# EAGLE design chall (EAGLE 9.6.2)
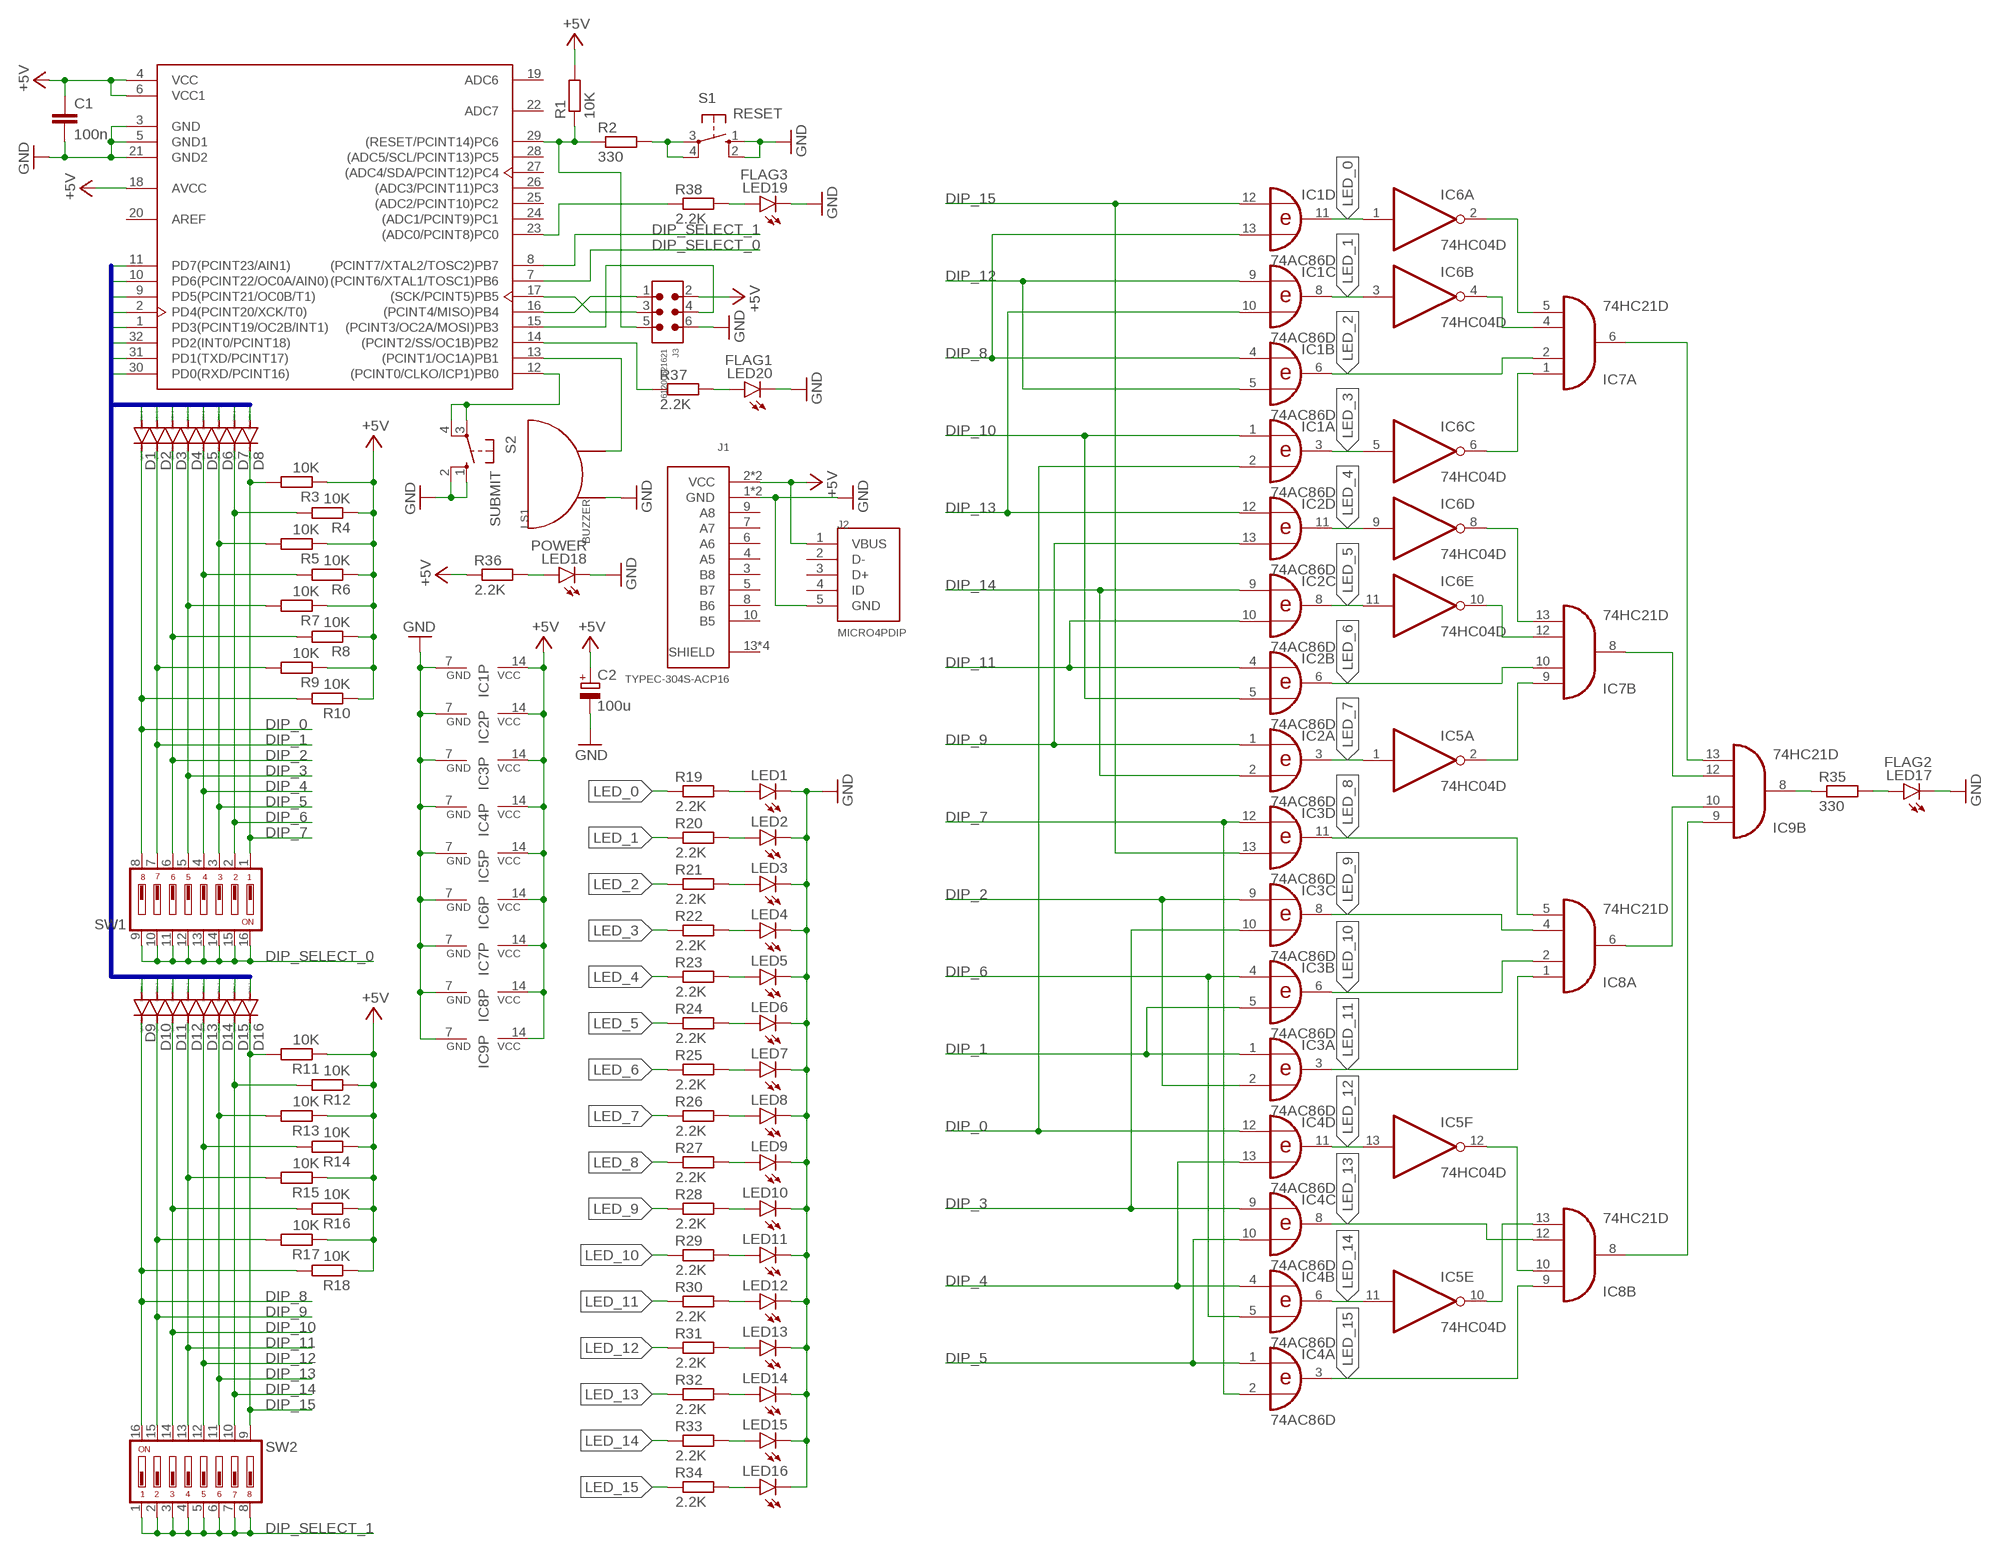
[diagram p0: schematic, sheet 1]

## Parts
C1  100n  C-EUC0805  [C0805]
C2  100u  CPOL-EUE2-5  [E2-5]
D1  DIODE-DO-214AC  [DO-214AC]
D2  DIODE-DO-214AC  [DO-214AC]
D3  DIODE-DO-214AC  [DO-214AC]
D4  DIODE-DO-214AC  [DO-214AC]
D5  DIODE-DO-214AC  [DO-214AC]
D6  DIODE-DO-214AC  [DO-214AC]
D7  DIODE-DO-214AC  [DO-214AC]
D8  DIODE-DO-214AC  [DO-214AC]
D9  DIODE-DO-214AC  [DO-214AC]
D10  DIODE-DO-214AC  [DO-214AC]
D11  DIODE-DO-214AC  [DO-214AC]
D12  DIODE-DO-214AC  [DO-214AC]
D13  DIODE-DO-214AC  [DO-214AC]
D14  DIODE-DO-214AC  [DO-214AC]
D15  DIODE-DO-214AC  [DO-214AC]
D16  DIODE-DO-214AC  [DO-214AC]
IC1  74AC86D  [SO14]
IC2  74AC86D  [SO14]
IC3  74AC86D  [SO14]
IC4  74AC86D  [SO14]
IC5  74HC04D  [SO14]
IC6  74HC04D  [SO14]
IC7  74HC21D  [SO14]
IC8  74HC21D  [SO14]
IC9  74HC21D  [SO14]
J1  TYPEC-304S-ACP16  [TYPEC-304S-ACP16]
J2  MICRO4PDIP  [MICRO4PDIP]
J3  61200621621  6120XX21621_61200621621  [61200621621]
LED1  LEDCHIPLED_0603  [CHIPLED_0603]
LED2  LEDCHIPLED_0603  [CHIPLED_0603]
LED3  LEDCHIPLED_0603  [CHIPLED_0603]
LED4  LEDCHIPLED_0603  [CHIPLED_0603]
LED5  LEDCHIPLED_0603  [CHIPLED_0603]
LED6  LEDCHIPLED_0603  [CHIPLED_0603]
LED7  LEDCHIPLED_0603  [CHIPLED_0603]
LED8  LEDCHIPLED_0603  [CHIPLED_0603]
LED9  LEDCHIPLED_0603  [CHIPLED_0603]
LED10  LEDCHIPLED_0603  [CHIPLED_0603]
LED11  LEDCHIPLED_0603  [CHIPLED_0603]
LED12  LEDCHIPLED_0603  [CHIPLED_0603]
LED13  LEDCHIPLED_0603  [CHIPLED_0603]
LED14  LEDCHIPLED_0603  [CHIPLED_0603]
LED15  LEDCHIPLED_0603  [CHIPLED_0603]
LED16  LEDCHIPLED_0603  [CHIPLED_0603]
LED17  FLAG2  LEDCHIPLED_0603  [CHIPLED_0603]
LED18  POWER  LEDCHIPLED_0603  [CHIPLED_0603]
LED19  FLAG3  LEDCHIPLED_0603  [CHIPLED_0603]
LED20  FLAG1  LEDCHIPLED_0603  [CHIPLED_0603]
LS1  BUZZER  [BUZZER]
R1  10K  R-EU_R0805  [R0805]
R2  330  R-EU_R0805  [R0805]
R3  10K  R-EU_R0805  [R0805]
R4  10K  R-EU_R0805  [R0805]
R5  10K  R-EU_R0805  [R0805]
R6  10K  R-EU_R0805  [R0805]
R7  10K  R-EU_R0805  [R0805]
R8  10K  R-EU_R0805  [R0805]
R9  10K  R-EU_R0805  [R0805]
R10  10K  R-EU_R0805  [R0805]
R11  10K  R-EU_R0805  [R0805]
R12  10K  R-EU_R0805  [R0805]
R13  10K  R-EU_R0805  [R0805]
R14  10K  R-EU_R0805  [R0805]
R15  10K  R-EU_R0805  [R0805]
R16  10K  R-EU_R0805  [R0805]
R17  10K  R-EU_R0805  [R0805]
R18  10K  R-EU_R0805  [R0805]
R19  2.2K  R-EU_R0805  [R0805]
R20  2.2K  R-EU_R0805  [R0805]
R21  2.2K  R-EU_R0805  [R0805]
R22  2.2K  R-EU_R0805  [R0805]
R23  2.2K  R-EU_R0805  [R0805]
R24  2.2K  R-EU_R0805  [R0805]
R25  2.2K  R-EU_R0805  [R0805]
R26  2.2K  R-EU_R0805  [R0805]
R27  2.2K  R-EU_R0805  [R0805]
R28  2.2K  R-EU_R0805  [R0805]
R29  2.2K  R-EU_R0805  [R0805]
R30  2.2K  R-EU_R0805  [R0805]
R31  2.2K  R-EU_R0805  [R0805]
R32  2.2K  R-EU_R0805  [R0805]
R33  2.2K  R-EU_R0805  [R0805]
R34  2.2K  R-EU_R0805  [R0805]
R35  330  R-EU_R0805  [R0805]
R36  2.2K  R-EU_R0805  [R0805]
R37  2.2K  R-EU_R0805  [R0805]
R38  2.2K  R-EU_R0805  [R0805]
S1  RESET  10-XX  [B3F-10XX]
S2  SUBMIT  10-XX  [B3F-10XX]
SW1  DS08  [DS-08]
SW2  DS08  [DS-08]
U1  ATMEGA328P-AU  [TQFP-32]

## Nets
0: D1.A D16.A U1.30(PD0(RXD/PCINT16))
1: D2.A D15.A U1.31(PD1(TXD/PCINT17))
2: D3.A D14.A U1.32(PD2(INT0/PCINT18))
3: D4.A D13.A U1.1(PD3(PCINT19/OC2B/INT1))
4: D5.A D12.A U1.2(PD4(PCINT20/XCK/T0))
5: D6.A D11.A U1.9(PD5(PCINT21/OC0B/T1))
6: D7.A D10.A U1.10(PD6(PCINT22/OC0A/AIN0))
7: D8.A D9.A U1.11(PD7(PCINT23/AIN1))
+5V: C1.1 C2.+ IC1.14(P:VCC) IC2.14(P:VCC) IC3.14(P:VCC) IC4.14(P:VCC) IC5.14(P:VCC) IC6.14(P:VCC) IC7.14(P:VCC) IC8.14(P:VCC) IC9.14(P:VCC) J1.2(VCC) J1.11(VCC) J2.1(VBUS) J3.2 R1.2 R3.1 R4.1 R5.1 R6.1 R7.1 R8.1 R9.1 R10.1 R11.1 R12.1 R13.1 R14.1 R15.1 R16.1 R17.1 R18.1 R36.1 U1.4(VCC) U1.6(VCC1) U1.18(AVCC)
DIP_0: D1.C IC1.2(A:I1) IC4.12(D:I0) R10.2 SW1.8
DIP_1: D2.C IC3.1(A:I0) IC3.5(B:I1) R9.2 SW1.7
DIP_2: D3.C IC3.2(A:I1) IC3.9(C:I0) R8.2 SW1.6
DIP_3: D4.C IC3.10(C:I1) IC4.9(C:I0) R7.2 SW1.5
DIP_4: D5.C IC4.4(B:I0) IC4.13(D:I1) R6.2 SW1.4
DIP_5: D6.C IC4.1(A:I0) IC4.10(C:I1) R5.2 SW1.3
DIP_6: D7.C IC3.4(B:I0) IC4.5(B:I1) R4.2 SW1.2
DIP_7: D8.C IC3.12(D:I0) IC4.2(A:I1) R3.2 SW1.1
DIP_8: D9.C IC1.4(B:I0) IC1.13(D:I1) R18.2 SW2.16
DIP_9: D10.C IC2.1(A:I0) IC2.13(D:I1) R17.2 SW2.15
DIP_10: D11.C IC1.1(A:I0) IC2.5(B:I1) R16.2 SW2.14
DIP_11: D12.C IC2.4(B:I0) IC2.10(C:I1) R15.2 SW2.13
DIP_12: D13.C IC1.5(B:I1) IC1.9(C:I0) R14.2 SW2.12
DIP_13: D14.C IC1.10(C:I1) IC2.12(D:I0) R13.2 SW2.11
DIP_14: D15.C IC2.2(A:I1) IC2.9(C:I0) R12.2 SW2.10
DIP_15: D16.C IC1.12(D:I0) IC3.13(D:I1) R11.2 SW2.9
DIP_SELECT_0: SW1.9 SW1.10 SW1.11 SW1.12 SW1.13 SW1.14 SW1.15 SW1.16 U1.7((PCINT6/XTAL1/TOSC1)PB6)
DIP_SELECT_1: SW2.1 SW2.2 SW2.3 SW2.4 SW2.5 SW2.6 SW2.7 SW2.8 U1.8((PCINT7/XTAL2/TOSC2)PB7)
GND: C1.2 C2.- IC1.7(P:GND) IC2.7(P:GND) IC3.7(P:GND) IC4.7(P:GND) IC5.7(P:GND) IC6.7(P:GND) IC7.7(P:GND) IC8.7(P:GND) IC9.7(P:GND) J1.1(GND) J1.12(GND) J2.5(GND) J3.6 LED1.C LED2.C LED3.C LED4.C LED5.C LED6.C LED7.C LED8.C LED9.C LED10.C LED11.C LED12.C LED13.C LED14.C LED15.C LED16.C LED17.C LED18.C LED19.C LED20.C LS1.1 S1.1(S) S1.2(S1) S2.1(S) S2.2(S1) U1.3(GND) U1.5(GND1) U1.21(GND2)
LED_0: IC1.11(D:O) IC6.1(A:I) R19.1
LED_1: IC1.8(C:O) IC6.3(B:I) R20.1
LED_2: IC1.6(B:O) IC7.2(A:I1) R21.1
LED_3: IC1.3(A:O) IC6.5(C:I) R22.1
LED_4: IC2.11(D:O) IC6.9(D:I) R23.1
LED_5: IC2.8(C:O) IC6.11(E:I) R24.1
LED_6: IC2.6(B:O) IC7.10(B:I1) R25.1
LED_7: IC2.3(A:O) IC5.1(A:I) R26.1
LED_8: IC3.11(D:O) IC8.5(A:I3) R27.1
LED_9: IC3.8(C:O) IC8.4(A:I2) R28.1
LED_10: IC3.6(B:O) IC8.2(A:I1) R29.1
LED_11: IC3.3(A:O) IC8.1(A:I0) R30.1
LED_12: IC4.11(D:O) IC5.13(F:I) R31.1
LED_13: IC4.8(C:O) IC8.12(B:I2) R32.1
LED_14: IC4.6(B:O) IC5.11(E:I) R33.1
LED_15: IC4.3(A:O) IC8.9(B:I0) R34.1
N$1: R2.2 S1.3(P) S1.4(P1)
N$2: LED2.A R20.2
N$3: J3.5 R1.1 R2.1 U1.29((RESET/PCINT14)PC6)
N$4: J3.3 U1.17((SCK/PCINT5)PB5)
N$5: IC6.2(A:O) IC7.5(A:I3)
N$6: IC6.4(B:O) IC7.4(A:I2)
N$7: LED3.A R21.2
N$8: IC6.6(C:O) IC7.1(A:I0)
N$9: IC6.8(D:O) IC7.13(B:I3)
N$10: IC6.10(E:O) IC7.12(B:I2)
N$11: LED4.A R22.2
N$12: IC5.2(A:O) IC7.9(B:I0)
N$13: LED5.A R23.2
N$14: LED6.A R24.2
N$15: LED7.A R25.2
N$16: LED8.A R26.2
N$17: IC5.12(F:O) IC8.10(B:I1)
N$18: LED9.A R27.2
N$19: IC5.10(E:O) IC8.13(B:I3)
N$20: LED10.A R28.2
N$21: IC7.8(B:O) IC9.12(B:I2)
N$22: IC7.6(A:O) IC9.13(B:I3)
N$23: IC8.6(A:O) IC9.10(B:I1)
N$24: IC8.8(B:O) IC9.9(B:I0)
N$25: LED11.A R29.2
N$26: LED12.A R30.2
N$27: LED13.A R31.2
N$28: LED14.A R32.2
N$29: LED15.A R33.2
N$30: LED16.A R34.2
N$31: S2.3(P) S2.4(P1) U1.12((PCINT0/CLKO/ICP1)PB0)
N$32: LED19.A R38.2
N$33: LED1.A R19.2
N$34: R38.1 U1.23((ADC0/PCINT8)PC0)
N$35: LED20.A R37.2
N$37: LED17.A R35.2
N$50: IC9.8(B:O) R35.1
N$51: LS1.2 U1.13((PCINT1/OC1A)PB1)
N$52: LED18.A R36.2
N$53: J3.1 U1.16((PCINT4/MISO)PB4)
N$54: J3.4 U1.15((PCINT3/OC2A/MOSI)PB3)
N$55: R37.1 U1.14((PCINT2/SS/OC1B)PB2)
Unconnected: IC5.3(B:I) IC5.4(B:O) IC5.5(C:I) IC5.6(C:O) IC5.8(D:O) IC5.9(D:I) IC6.12(F:O) IC6.13(F:I) IC9.1(A:I0) IC9.2(A:I1) IC9.4(A:I2) IC9.5(A:I3) IC9.6(A:O) J1.3(B8) J1.4(A5) J1.5(B7) J1.6(A6) J1.7(A7) J1.8(B6) J1.9(A8) J1.10(B5) J1.13(SHIELD) J1.14(SHIELD) J1.15(SHIELD) J1.16(SHIELD) J2.2(D-) J2.3(D+) J2.4(ID) U1.19(ADC6) U1.22(ADC7) U1.24((ADC1/PCINT9)PC1) U1.25((ADC2/PCINT10)PC2) U1.26((ADC3/PCINT11)PC3) U1.27((ADC4/SDA/PCINT12)PC4) U1.28((ADC5/SCL/PCINT13)PC5)

## Buses
DIPSWITCH:0,1,2,3,4,5,6,7

## Power pins joined to a net without a drawn wire
AREF: U1.20(AREF)

## Library data of the parts
C1 = rcl:C-EU: CAPACITOR, European symbol; SPICEPREFIX: C
C2 = rcl:CPOL-EU: POLARIZED CAPACITOR, European symbol; SPICEPREFIX: C
D1-D16 = diode:DIODE-: DIODE
IC1-IC4 = 74xx-eu:74*86: Quad 2-input EXCLUSIVE-OR (XOR) gate
IC5 IC6 = 74xx-eu:74*04: Hex INVERTER
IC7-IC9 = 74xx-eu:74*21: Dual 4-input AND gate
J1 = hardwarechall:TYPEC-304S-ACP16
J2 = hardwarechall:MICRO4PDIP
J3 = Wurth_Connectors_WR-BHD:6120XX21621_61200621621: WR-BHD 2.54 mm Male Box Header KIND PROPERTIES: Pitch 2.54 mm Gender:Male MATERIAL PROPERTIES: Insulator Material:PBT Insulator Flammability Rating UL94 V-0 Insulator Color:Black Contact Material :Copper Alloy Contact Plating :Gold Contact Type: Stamped GENERAL INFORMATION: Operating Temperature:-40 °C up to +125 °C Compliance:RoHS Working Voltage: 250 V (AC) Withstanding Voltage:500 V (AC) Contact Resistance: 20 mΩ Insulation Resistance:1000 MΩ CERTIFICATION: UL Approval:E323964 PACKAGING PROPERTIES Packaging :Tray <https://www.we-online.com/catalog/media/o32884v209%20Family_WR-BHD_6120xx21621.jpg> Details see: https://www.we-online.com/catalog/en/BHD_2_54_MALE_BOX_HEADER_6120XX21621 Updated by Ella Wu 2021-3-12 2021 (C) Würth Elektronik; CONTACT-RESISTANCE: 20mOhm; DATASHEET-URL: https://www.we-online.com/catalog/datasheet/61200621621.pdf; GENDER: Male; IR: 3A; L: 15.28mm; MOUNT: THT; PACKAGING: Tray; PART-NUMBER: 61200621621; PINS: 6; PITCH: 2.54mm; TYPE: Straight; WORKING-VOLTAGE: 250V(AC)
LED1-LED20 = led:LED: LED OSRAM: - CHIPLED LG R971, LG N971, LY N971, LG Q971, LY Q971, LO R971, LY R971 LH N974, LH R974 LS Q976, LO Q976, LY Q976 LO Q996 - Hyper CHIPLED LW Q18S LB Q993, LB Q99A, LB R99A - SideLED LS A670, LO A670, LY A670, LG A670, LP A670 LB A673, LV A673, LT A673, LW A673 LH A674 LY A675 LS A676, LA A676, LO A676, LY A676, LW A676 LS A679, LY A679, LG A679 - Hyper Micro SIDELED® LS Y876, LA Y876, LO Y876, LY Y876 LT Y87S - SmartLED LW L88C, LW L88S LB L89C, LB L89S, LG L890 LS L89K, LO L89K, LY L89K LS L896, LA L896, LO L896, LY L896 - TOPLED LS T670, LO T670, LY T670, LG T670, LP T670 LSG T670, LSP T670, LSY T670, LOP T670, LYG T670 LG T671, LOG T671, LSG T671 LB T673, LV T673, LT T673, LW T673 LH T674 LS T676, LA T676, LO T676, LY T676, LB T676, LH T676, LSB T676, LW T676 LB T67C, LV T67C, LT T67C, LS T67K, LO T67K, LY T67K, LW E67C LS E67B, LA E67B, LO E67B, LY E67B, LB E67C, LV E67C, LT E67C LW T67C LS T679, LY T679, LG T679 LS T770, LO T770, LY T770, LG T770, LP T770 LB T773, LV T773, LT T773, LW T773 LH T774 LS E675, LA E675, LY E675, LS T675 LS T776, LA T776, LO T776, LY T776, LB T776 LHGB T686 LT T68C, LB T68C - Hyper Mini TOPLED® LB M676 - Mini TOPLED Santana® LG M470 LS M47K, LO M47K, LY M47K Source: http://www.osram.convergy.de LUXEON: - LUMILED® LXK2-PW12-R00, LXK2-PW12-S00, LXK2-PW14-U00, LXK2-PW14-V00 LXK2-PM12-R00, LXK2-PM12-S00, LXK2-PM14-U00 LXK2-PE12-Q00, LXK2-PE12-R00, LXK2-PE12-S00, LXK2-PE14-T00, LXK2-PE14-U00 LXK2-PB12-K00, LXK2-PB12-L00, LXK2-PB12-M00, LXK2-PB14-N00, LXK2-PB14-P00, LXK2-PB14-Q00 LXK2-PR12-L00, LXK2-PR12-M00, LXK2-PR14-Q00, LXK2-PR14-R00 LXK2-PD12-Q00, LXK2-PD12-R00, LXK2-PD12-S00 LXK2-PH12-R00, LXK2-PH12-S00 LXK2-PL12-P00, LXK2-PL12-Q00, LXK2-PL12-R00 Source: www.luxeon.com KINGBRIGHT: KA-3528ASYC Source: www.kingbright.com
LS1 = hardwarechall:BUZZER
R1-R38 = rcl:R-EU_: RESISTOR, European symbol; SPICEPREFIX: R
S1 S2 = switch-omron:10-XX: OMRON SWITCH; MPN: B3F-1000; OC_FARNELL: 176432; OC_NEWARK: 36M3542
SW1 SW2 = switch-dil:DS08: DIL/CODE SWITCH; MPN: DS08; OC_FARNELL: unknown; OC_NEWARK: 73J0071
U1 = Microcontroller:ATMEGA328P-AU: IC MCU 8BIT 32KB FLASH 32TQFP Manufacturer's datasheet <http://ww1.microchip.com/downloads/en/DeviceDoc/ATmega48A-PA-88A-PA-168A-PA-328-P-DS-DS40002061A.pdf>; CREATED_BY: PCBLayout.com; DIGIKEY_PART_NUMBER: ATMEGA328P-AU-ND; MANUFACTURER: Microchip Technology; MPN: ATMEGA328P-AU; PACKAGE: TQFP-32

## Board
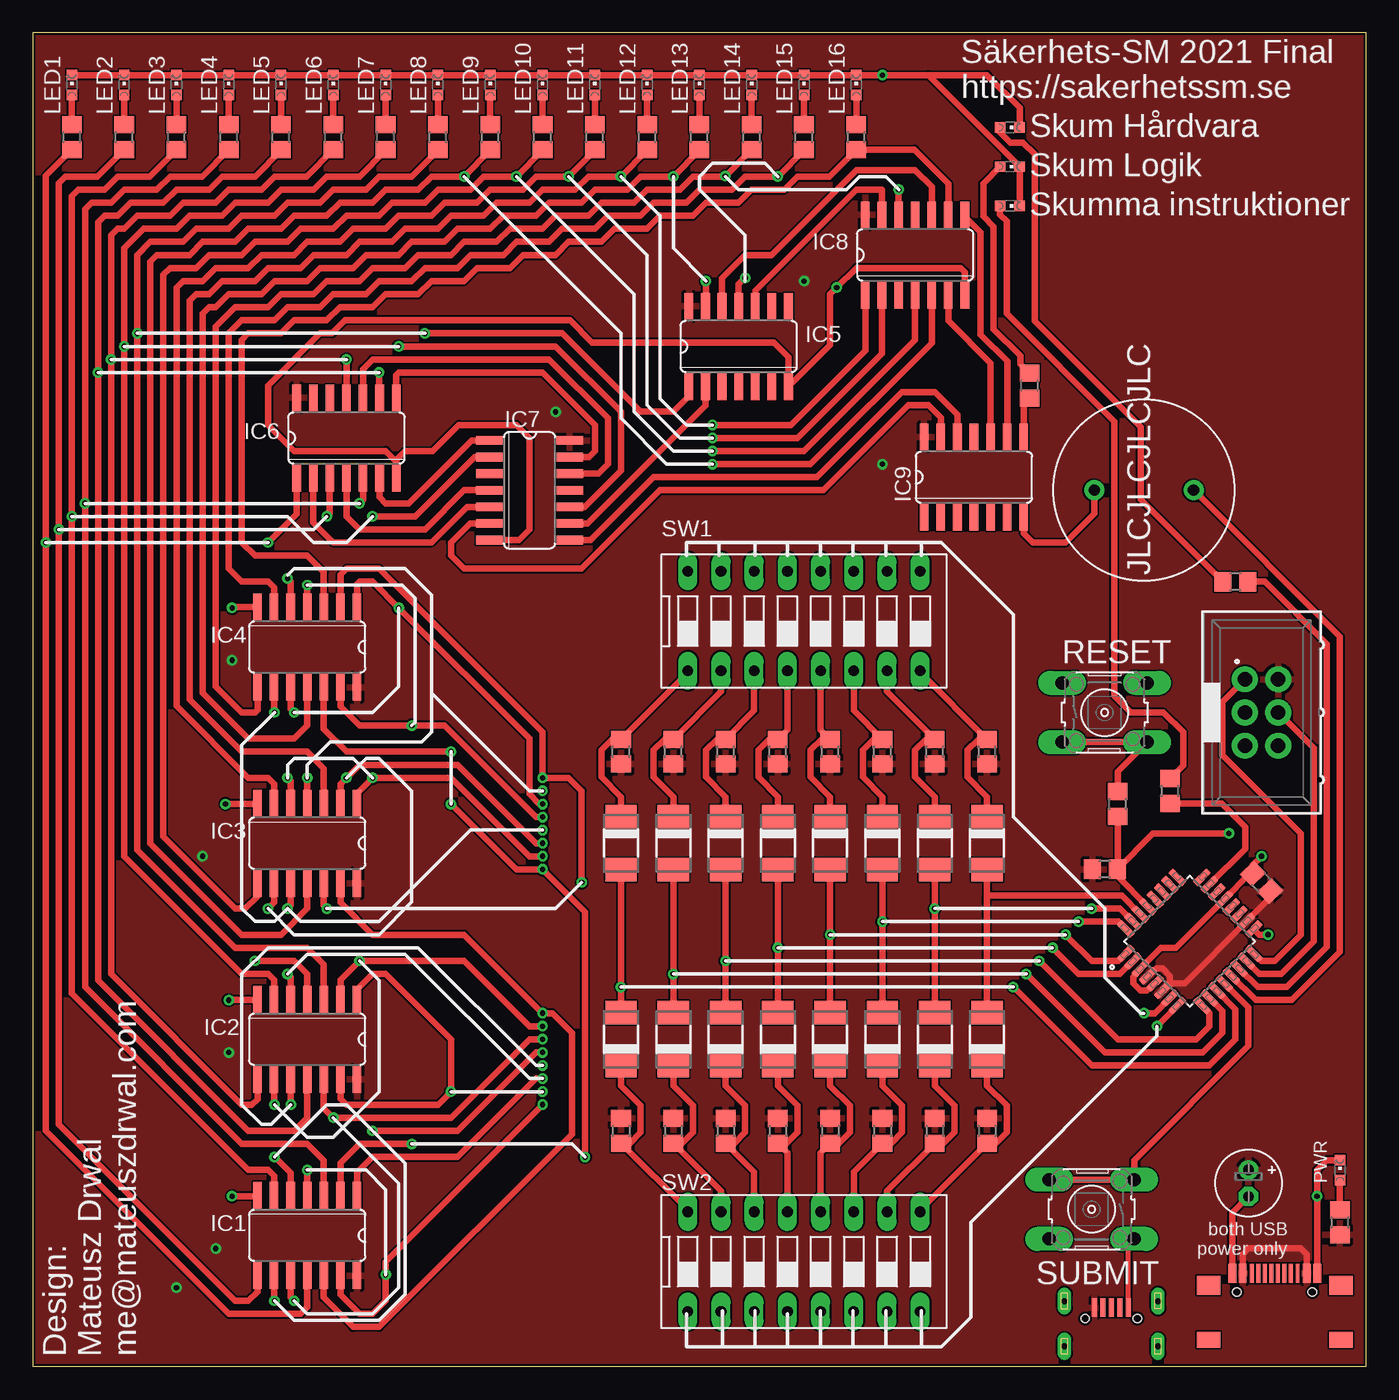
[diagram p1: board, top side]
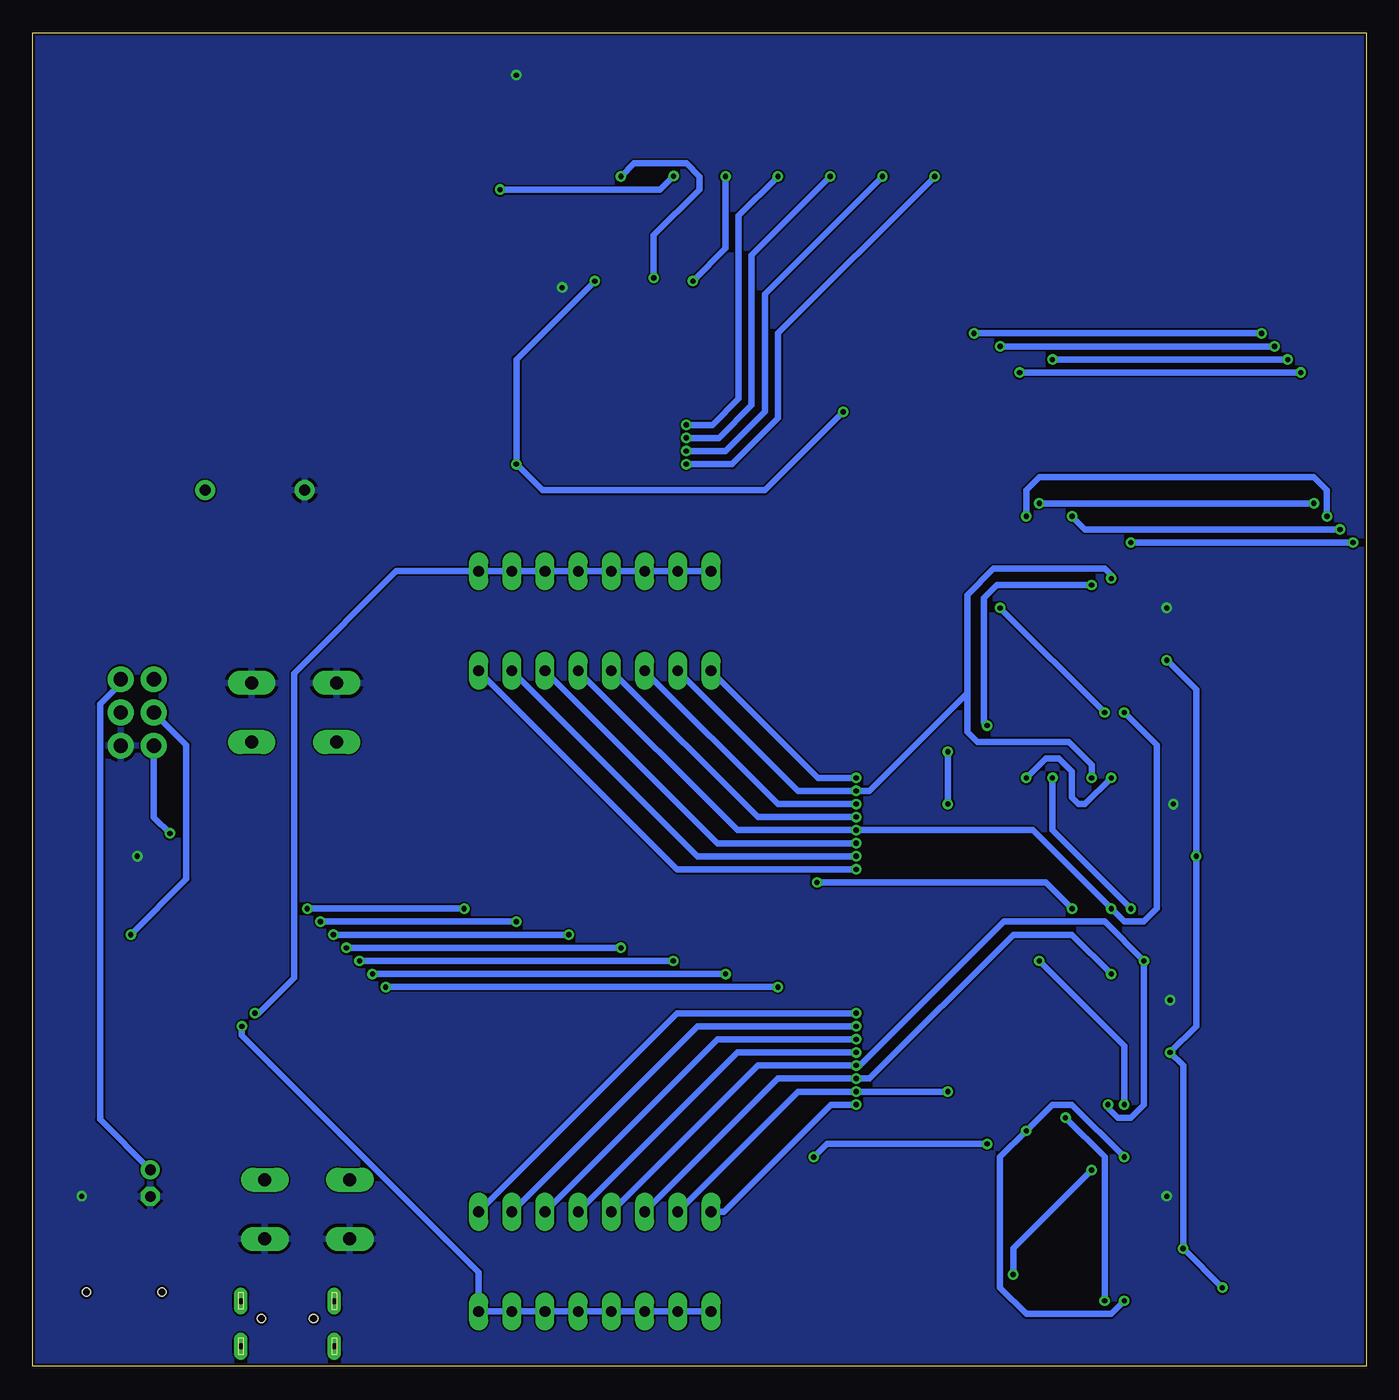
[diagram p2: board, bottom side, seen from below]

Size 102 x 102 mm. Coordinates in mm from the lower left corner, seen from the top.
Outline: 0,0 102,0 102,102 0,102 0,0
Copper layers (1*16): Top 0.035mm / dielectric 1.6mm / Bottom 0.035mm
Design rules "jlcpcb": minimum track width 5mil, minimum drill 0.3mm, track to track 5mil, track to pad 5mil, pad to pad 5mil, via to via 5mil, smd to smd 5mil, copper to edge 0.2mm, drill to drill 6mil, minimum pad ring 10mil, minimum via ring 3mil, stop-mask expansion 4mil, vias tented up to drill 0mil, thermal gap 10mil

### Footprints (pad centres in the part's own frame; a part is rotated, then mirrored left to right if it is on the bottom)
C0805 = smd 1.3 x 1.5: 1 -0.95,0; 2 0.95,0
E2-5 = drill 0.813 pad 1.27: + -1.016,0 | drill 0.813 pad 1.27 octagon: - 1.016,0
DO-214AC = smd 1.8 x 2.4: A 2.025,0; C -2.025,0
SO14 = smd 0.66 x 2.032: 1 -3.81,-3.073; 2 -2.54,-3.073; 3 -1.27,-3.073; 4 0,-3.073; 5 1.27,-3.073; 6 2.54,-3.073; 7 3.81,-3.073; 8 3.81,3.073; 9 2.54,3.073; 10 1.27,3.073; 11 0,3.073; 12 -1.27,3.073; 13 -2.54,3.073; 14 -3.81,3.073
TYPEC-304S-ACP16 = smd 0.6 x 1.45: 1 -3.25,2.615; 2 -2.45,2.615; 11 2.45,2.615; 12 3.25,2.615 | smd 0.3 x 1.45: 3 -1.75,2.615; 4 -1.25,2.615; 5 -0.75,2.615; 6 -0.25,2.615; 7 0.25,2.615; 8 0.75,2.615; 9 1.25,2.615; 10 1.75,2.615 | smd 1.8 x 1.45: 13 -5.07,1.7; 14 5.07,1.7 | smd 1.8 x 1.2: 15 -5.07,-2.48; 16 5.07,-2.48 | hole 0.65: -2.89,1.17; 2.89,1.17
MICRO4PDIP = smd 0.4 x 1.4: 1 -1.3,1.225; 2 -0.65,1.225; 3 0,1.225; 4 0.65,1.225; 5 1.3,1.225 | drill 0.45 pad 1.05 long: P$1 -3.575,1.725; P$2 3.575,1.725; P$3 3.575,-1.725; P$4 -3.575,-1.725 | hole 0.65: -2,0.4; 2,0.4
61200621621 = drill 1.1: 1 -2.54,-1.27; 2 -2.54,1.27; 3 0,-1.27; 4 0,1.27; 5 2.54,-1.27; 6 2.54,1.27
CHIPLED_0603 = smd 0.8 x 0.8: A 0,-0.75; C 0,0.75
BUZZER = drill 0.85: 1 -3.8,0; 2 3.8,0
R0805 = smd 1.3 x 1.5: 1 -0.95,0; 2 0.95,0
B3F-10XX = drill 1.016 long: 1 -3.251,2.261; 2 3.251,2.261; 3 -3.251,-2.261; 4 3.251,-2.261
DS-08 = drill 0.813 long: 1 -8.89,-3.81; 2 -6.35,-3.81; 3 -3.81,-3.81; 4 -1.27,-3.81; 5 1.27,-3.81; 6 3.81,-3.81; 7 6.35,-3.81; 8 8.89,-3.81; 9 8.89,3.81; 10 6.35,3.81; 11 3.81,3.81; 12 1.27,3.81; 13 -1.27,3.81; 14 -3.81,3.81; 15 -6.35,3.81; 16 -8.89,3.81
TQFP-32 = smd 1.5 x 0.57: 1 -4.13,2.8; 2 -4.13,2; 3 -4.13,1.2; 4 -4.13,0.4; 5 -4.13,-0.4; 6 -4.13,-1.2; 7 -4.13,-2; 8 -4.13,-2.8; 17 4.13,-2.8; 18 4.13,-2; 19 4.13,-1.2; 20 4.13,-0.4; 21 4.13,0.4; 22 4.13,1.2; 23 4.13,2; 24 4.13,2.8 | smd 0.57 x 1.5: 9 -2.8,-4.13; 10 -2,-4.13; 11 -1.2,-4.13; 12 -0.4,-4.13; 13 0.4,-4.13; 14 1.2,-4.13; 15 2,-4.13; 16 2.8,-4.13; 25 2.8,4.13; 26 2,4.13; 27 1.2,4.13; 28 0.4,4.13; 29 -0.4,4.13; 30 -1.2,4.13; 31 -2,4.13; 32 -2.8,4.13

### Placement (x,y rotation side)
C1  94,37 135 top
C2  93,14 270 top
D1  73,40 270 top
D2  69,40 270 top
D3  65,40 270 top
D4  61,40 270 top
D5  57,40 270 top
D6  53,40 270 top
D7  49,40 270 top
D8  45,40 270 top
D9  45,25 90 top
D10  49,25 90 top
D11  53,25 90 top
D12  57,25 90 top
D13  61,25 90 top
D14  65,25 90 top
D15  69,25 90 top
D16  73,25 90 top
IC1  21,10 180 top
IC2  21,25 180 top
IC3  21,40 180 top
IC4  21,55 180 top
IC5  54,78 0 top
IC6  24,71 0 top
IC7  38,67 270 top
IC8  67.5,85 0 top
IC9  72,68 0 top
J1  95,4.5 0 top
J2  82.5,3.25 0 top
J3  94,50 270 top
LED1  3,98 0 top
LED2  7,98 0 top
LED3  11,98 0 top
LED4  15,98 0 top
LED5  19,98 0 top
LED6  23,98 0 top
LED7  27,98 0 top
LED8  31,98 0 top
LED9  35,98 0 top
LED10  39,98 0 top
LED11  43,98 0 top
LED12  47,98 0 top
LED13  51,98 0 top
LED14  55,98 0 top
LED15  59,98 0 top
LED16  63,98 0 top
LED17  74.75,91.75 270 top
LED18  100,15 0 top
LED19  74.75,88.75 270 top
LED20  74.75,94.75 270 top
LS1  85,67 0 top
R1  82,38 180 top
R2  83,43 90 top
R3  45,47 90 top
R4  49,47 90 top
R5  53,47 90 top
R6  57,47 90 top
R7  61,47 90 top
R8  65,47 90 top
R9  69,47 90 top
R10  73,47 90 top
R11  73,18 270 top
R12  69,18 270 top
R13  65,18 270 top
R14  61,18 270 top
R15  57,18 270 top
R16  53,18 270 top
R17  49,18 270 top
R18  45,18 270 top
R19  3,94 90 top
R20  7,94 90 top
R21  11,94 90 top
R22  15,94 90 top
R23  19,94 90 top
R24  23,94 90 top
R25  27,94 90 top
R26  31,94 90 top
R27  35,94 90 top
R28  39,94 90 top
R29  43,94 90 top
R30  47,94 90 top
R31  51,94 90 top
R32  55,94 90 top
R33  59,94 90 top
R34  63,94 90 top
R35  76.25,75 90 top
R36  100,11 90 top
R37  92,60 180 top
R38  87,44 90 top
S1  82,50 0 top
S2  81,12 180 top
SW1  59,57 0 top
SW2  59,8 0 top
U1  88.5,32.5 45 top

### Tracks (layer width: path | path; a pad name or v marks a point on that pad's centre or on a via)
0
  Top 0.5: D16.A 73,36 | D1.A 73,36 | U1.30 83.3,36 73,36
1  (via drill 0.4 pad 0.8)
  Top 0.5: D15.A v69,35 D2.A | v81,35 83.17,35 U1.31
  Bottom 0.5: v69,35 v81,35
2  (via drill 0.4 pad 0.8)
  Top 0.5: D14.A v65,34 D3.A | v80,34 83.04,34 U1.32
  Bottom 0.5: v65,34 v80,34
3  (via drill 0.4 pad 0.8)
  Top 0.5: D4.A v61,33 D13.A | U1.1 83.04,31 81,31 v79,33
  Bottom 0.5: v61,33 v79,33
4  (via drill 0.4 pad 0.8)
  Top 0.5: D12.A v57,32 D5.A | v78,32 80,30 83.17,30 U1.2
  Bottom 0.5: v57,32 v78,32
5  (via drill 0.4 pad 0.8)
  Top 0.5: D6.A v53,31 D11.A | U1.9 90,27.04 90,26 89,25 83,25 v77,31
  Bottom 0.5: v53,31 v77,31
6  (via drill 0.4 pad 0.8)
  Top 0.5: D10.A v49,30 D7.A | v76,30 82,24 89.5,24 91,25.5 91,27.17 U1.10
  Bottom 0.5: v49,30 v76,30
7  (via drill 0.4 pad 0.8)
  Top 0.5: D8.A v45,29 D9.A | v75,29 81,23 90,23 92,25 92,27.3 U1.11
  Bottom 0.5: v45,29 v75,29
+5V  (via drill 0.4 pad 0.8)
  Top 0.5: U1.4 85.39,29.86 85.95,30.42 86.44,30.42 86.99,29.87 86.99,29.38 86.43,28.82 | 86.43,28.82 U1.6 | 86.43,28.82 86.61,28.82 87.08,29.29 88.12,29.29 U1.18 94.67,35.84 C1.1 | J1.2 92.55,8.55 93,9 97,9 97.45,8.55 J1.11
  Bottom 0.5: v15.25,54 13,51.75 v13,39 13,26 v15,24 14,23 v14,9 v11,6 | v59,83 65,77 v65,69 63,67 46,67 v40,73 | J3.2 95.27,52.23 96.84,50.65 96.84,18.86 C2.+
  pour Top: -2,104 104,104 104,-4 -2,-4
DIP_0  (via drill 0.4 pad 0.8)
  Top 0.5: D1.C 73,43.55 71.5,45.05 71.5,47.12 72.33,47.95 R10.2 67.89,53.06 SW1.8 | IC1.2 23.54,15.54 25,17 v29,17 | v42.25,16 42.25,34.75 v39,38 37,38 v32,43 | IC4.12 22.27,48.73 24,47 v32,47
  Bottom 0.5: SW1.8 52.7,38 v39,38 | v29,17 41.25,17 v42.25,16 | v32,47 v32,43
DIP_1  (via drill 0.4 pad 0.8)
  Top 0.5: D2.C 69,43.55 67.5,45.05 67.5,47.12 68.33,47.95 R9.2 65.35,51.6 SW1.7 | IC3.1 24.81,43.81 v26,45 32,45 38,39 v39,39 | IC3.5 19.73,44.77 v19.5,45
  Bottom 0.5: SW1.7 51.16,39 v39,39 | v19.5,45 21.5,43 22,43 22.5,43.5 22.5,45.5 23.5,46.5 24.5,46.5 v26,45
DIP_2  (via drill 0.4 pad 0.8)
  Top 0.5: D3.C 65,43.55 63.5,45.05 63.5,47.12 64.33,47.95 R8.2 62.81,50.14 SW1.6 | IC3.9 18.46,35.46 v18,35 | v39,40 38.5,40 32.5,46 25,46 v24,45 23.54,44.54 IC3.2
  Bottom 0.5: SW1.6 49.62,40 v39,40 | v18,35 24,41 v24,45
DIP_3  (via drill 0.4 pad 0.8)
  Top 0.5: D4.C 61,43.55 59.5,45.05 59.5,47.12 60.33,47.95 R7.2 60.27,48.68 SW1.5 | IC4.9 18.46,50.04 v18.5,50 | IC3.10 19.73,35.23 v19.5,35
  Bottom 0.5: SW1.5 48.08,41 v39,41 25.5,41 v19.5,35 18.5,34 17,34 16,35 16,47.5 v18.5,50
DIP_4  (via drill 0.4 pad 0.8)
  Top 0.5: D5.C 57,43.55 55.5,45.05 55.5,47.12 56.33,47.95 R6.2 57.73,48.68 SW1.4 | IC4.4 v21,59.75 | v39,42 38.5,42 31.5,49 v29,49 25,49 23.54,50.46 IC4.13
  Bottom 0.5: SW1.4 46.54,42 v39,42 | v21,59.75 28.25,59.75 29.25,58.75 29.25,49.25 v29,49
DIP_5  (via drill 0.4 pad 0.8)
  Top 0.5: D6.C 53,43.55 51.5,45.05 51.5,47.12 52.33,47.95 R5.2 55.19,50.14 SW1.3 | IC4.1 24.81,59.81 25,60 26,60 v28,58 38,48 38,43.75 38.75,43 v39,43 | IC4.10 19.73,50.27 v20,50
  Bottom 0.5: SW1.3 45,43 v39,43 | v20,50 v28,58
DIP_6  (via drill 0.4 pad 0.8)
  Top 0.5: D7.C 49,43.55 47.5,45.05 47.5,47.12 48.33,47.95 R4.2 52.65,51.6 SW1.2 | IC4.5 19.73,60.02 v19.5,60.25 | IC3.4 v21,45
  Bottom 0.5: SW1.2 43.46,44 v39,44 38,44 30.5,51.5 | v21,45 21,46 22.75,47.75 29.75,47.75 30.5,48.5 30.5,51.5 | 30.5,51.5 30.5,59 28.5,61 20,61 19.5,60.5 v19.5,60.25
DIP_7  (via drill 0.4 pad 0.8)
  Top 0.5: D8.C 45,43.55 43.5,45.05 43.5,47.12 44.33,47.95 R3.2 50.11,53.06 SW1.1 | IC4.2 23.54,60.54 24,61 26.5,61 39,48.5 v39,45 41,45 42,44 v42,37 | IC3.12 22.27,35.23 v22.5,35
  Bottom 0.5: SW1.1 41.92,45 v39,45 | v22.5,35 24.5,37 v42,37
DIP_8  (via drill 0.4 pad 0.8)
  Top 0.5: SW2.16 50.11,11.94 R18.2 45.67,17.05 46.5,17.88 46.5,19.95 45,21.45 D9.C | v39,20 27,8 v27,7 27,5 26,4 25,4 23.54,5.46 IC1.13 | IC1.4 v21,15
  Bottom 0.5: SW2.16 49.11,11.81 40.92,20 v39,20 | v21,15 27,9 v27,7
DIP_9  (via drill 0.4 pad 0.8)
  Top 0.5: SW2.15 52.65,13.4 R17.2 49.67,17.05 50.5,17.88 50.5,19.95 49,21.45 D10.C | IC2.13 23.54,20.46 24,20 31,20 v32,21 32,25 27,30 26,30 24.81,28.81 IC2.1
  Bottom 0.5: SW2.15 43.46,21 v39,21 v32,21
DIP_10  (via drill 0.4 pad 0.8)
  Top 0.5: SW2.14 55.19,14.86 R16.2 53.67,17.05 54.5,17.88 54.5,19.95 53,21.45 D11.C | IC1.1 24.81,14.81 26,16 32.5,16 38.5,22 v39,22 | IC2.5 19.73,29.77 v19.5,30
  Bottom 0.5: SW2.14 45,22 v39,22 38,22 27,33 22.5,33 v19.5,30
DIP_11  (via drill 0.4 pad 0.8)
  Top 0.5: SW2.13 57.73,16.32 R15.2 57.67,17.05 58.5,17.88 58.5,19.95 57,21.45 D12.C | IC2.4 21,30 20,31 v17,31 | v19.75,20 19.75,21.91 IC2.10
  Bottom 0.5: SW2.13 46.54,23 v39,23 38.72,23 27.72,34 20,34 v17,31 17,20 18,19 19,19 19.75,19.75 v19.75,20
DIP_12  (via drill 0.4 pad 0.8)
  Top 0.5: SW2.12 60.27,16.32 R14.2 61.67,17.05 62.5,17.88 62.5,19.95 61,21.45 D13.C | v26,18 32.5,18 38.5,24 v39,24 | v18.5,5 18.46,5.04 IC1.9 | v18.5,16 19.73,14.77 IC1.5
  Bottom 0.5: SW2.12 48.08,24 v39,24 | v18.5,5 19.5,4 26,4 28,6 28,16 v26,18 24,20 22.5,20 v18.5,16
DIP_13  (via drill 0.4 pad 0.8)
  Top 0.5: SW2.11 62.81,14.86 R13.2 65.67,17.05 66.5,17.88 66.5,19.95 65,21.45 D14.C | IC1.10 19.73,5.27 v20,5 | IC2.12 22.27,19.73 v23,19 32,19 38,25 v39,25
  Bottom 0.5: SW2.11 49.62,25 v39,25 | v20,5 20,16 v23,19
DIP_14  (via drill 0.4 pad 0.8)
  Top 0.5: SW2.10 65.35,13.4 R12.2 69.67,17.05 70.5,17.88 70.5,19.95 69,21.45 D15.C | v39,26 38,26 33,31 v25,31 23.54,29.54 IC2.2 | IC2.9 18.46,20.04 v18.5,20
  Bottom 0.5: SW2.10 51.16,26 v39,26 | v18.5,20 18.5,24.5 v25,31
DIP_15  (via drill 0.4 pad 0.8)
  Top 0.5: SW2.9 67.89,11.94 R11.2 73.67,17.05 74.5,17.88 74.5,19.95 73,21.45 D16.C | IC3.13 23.54,35.46 26,33 33,33 v39,27 39.75,27 41.25,25.5 41.25,17.75 26.5,3 24.5,3 22.25,5.25 22.25,6.91 IC1.12
  Bottom 0.5: SW2.9 52.7,27 v39,27
DIP_SELECT_0  (via drill 0.4 pad 0.8)
  Top 0.5: U1.7 85.83,27 v85,27
  Bottom 0.5: v85,27 84.7,27 82,29.7 82,53 74.19,60.81 SW1.9 SW1.10 SW1.11 SW1.12 SW1.13 SW1.14 SW1.15 SW1.16
DIP_SELECT_1  (via drill 0.4 pad 0.8)
  Top 0.5: v86,26 87.56,27.56 U1.8
  Bottom 0.5: v86,26 86,25.3 67.89,7.19 SW2.8 SW2.7 SW2.6 SW2.5 SW2.4 SW2.3 SW2.2 SW2.1
GND  (via drill 0.4 pad 0.8)
  Top 0.4: J2.5 83.8,9.29 S2.1
  Top 0.5: U1.5 85.77,29.3 85.21,28.74 84.72,28.74 84.17,29.29 84.17,29.78 84.73,30.34 U1.3 86.3,32 87.43,32 U1.21 93.11,37.67 C1.2 93.33,38.33 v94,39 | IC4.7 15.25,58.07 v15.25,58 | IC3.7 17.12,43 v14.75,43 | IC2.7 17.12,28 v15,28 | IC1.7 17.12,13 v15.25,13 | LED1.C LED2.C LED3.C LED4.C LED5.C LED6.C LED7.C LED8.C LED9.C LED10.C LED11.C LED12.C LED13.C LED14.C LED15.C LED16.C v65,98.75 68.5,98.75 | J1.12 v98.25,13 98.25,15 99,15.75 LED18.C | IC8.7 71.31,83.69 71,84 63,84 v61.5,82.5 61,82 61,78.12 IC5.7 57.81,77.19 56.69,78.31 42.8,78.31 41.11,80 23.91,80 22.91,79 22,79 18,75 18,72 20,70 27,70 27.81,69.19 IC6.7 27.81,69.31 28.5,70 30.59,70 32.59,72 37,72 38,71 38,64 37.19,63.19 IC7.7 | 68.5,98.75 73,98.75 75.5,96.25 LED20.C | IC9.7 75.81,63.69 76.5,63 79,63 81.2,65.2 LS1.1 | 68.5,98.75 LED17.C LED19.C | C2.- 91.75,11.73 J1.1
  pour Bottom: -3,105 105,105 105,-5 -3,-5
LED_0  (via drill 0.4 pad 0.8)
  Top 0.5: IC1.11 21,4.5 20.5,4 15,4 1,18 v1,63 1,91.05 R19.1 | IC6.1 20.19,65.19 v18,63
  Bottom 0.5: v1,63 v18,63
LED_1  (via drill 0.4 pad 0.8)
  Top 0.5: IC1.8 17.19,5.69 16.5,5 15.5,5 2,18.5 v2,64 2,90.5 2.5,91 4.95,91 R20.1 | v22.5,65 22.73,65.23 IC6.3
  Bottom 0.5: v22.5,65 21.5,64 v2,64
LED_2  (via drill 0.4 pad 0.8)
  Top 0.5: IC1.6 18.46,14.54 18,15 16.5,15 3,28.5 v3,65 3,89.5 3.5,90 5.5,90 6.5,91 8.95,91 R21.1 | IC7.2 33.79,69.54 29.25,65 v26,65
  Bottom 0.5: v3,65 3,67 4,68 25,68 26,67 v26,65
LED_3  (via drill 0.4 pad 0.8)
  Top 0.5: IC1.3 22.27,15.73 21,17 16,17 4,29 v4,66 4,88.5 4.5,89 6,89 7,90 9.5,90 10.5,91 12.95,91 R22.1 | IC6.5 25.27,66.27 v25,66
  Bottom 0.5: v4,66 v25,66
LED_4  (via drill 0.4 pad 0.8)
  Top 0.5: IC2.11 21,19 20,18 16.5,18 5,29.5 v5,76 5,87.5 5.5,88 6.5,88 7.5,89 10,89 11,90 13.5,90 14.5,91 17,91 19,93 R23.1 | v26.5,76 26.5,74.11 IC6.9
  Bottom 0.5: v5,76 v26.5,76
LED_5  (via drill 0.4 pad 0.8)
  Top 0.5: IC2.8 17.19,20.43 16.76,20 16,20 6,30 v6,77 6,86.5 6.5,87 7,87 8,88 10.5,88 11.5,89 14,89 15,90 17.5,90 18.5,91 20.95,91 R24.1 | v24,77 IC6.11
  Bottom 0.5: v6,77 v24,77
LED_6  (via drill 0.4 pad 0.8)
  Top 0.5: IC2.6 18.46,29.54 18,30 16,30 7,39 v7,78 7,85.5 8.5,87 11,87 12,88 14.5,88 15.5,89 18,89 19,90 21.5,90 22.5,91 25,91 27,93 R25.1 | v28,78 40,78 45,73 45,68.5 42.23,65.73 IC7.10
  Bottom 0.5: v7,78 v28,78
LED_7  (via drill 0.4 pad 0.8)
  Top 0.5: IC2.3 22.27,30.73 21,32 15.5,32 8,39.5 v8,79 8,85 9,86 11.5,86 12.5,87 15,87 16,88 18.5,88 19.5,89 22,89 23,90 25.5,90 26.5,91 29,91 31,93 R26.1 | v30,79 40.5,79 46.5,73 49,73 50.19,74.19 IC5.1
  Bottom 0.5: v8,79 v30,79
LED_8  (via drill 0.4 pad 0.8)
  Top 0.5: IC3.11 21,35 19,33 16,33 9,40 9,84.5 9.5,85 12,85 13,86 15.5,86 16.5,87 19,87 20,88 22.5,88 23.5,89 26,89 27,90 29.5,90 30.5,91 v33,91 35,93 R27.1 | IC8.5 68.77,78.27 59.5,69 v52,69
  Bottom 0.5: v33,91 45,79 45,72.5 48.5,69 v52,69
LED_9  (via drill 0.4 pad 0.8)
  Top 0.5: IC3.8 17.19,35.93 16.26,35 15.5,35 10,40.5 10,83.5 10.5,84 12.5,84 13.5,85 16,85 17,86 19.5,86 20.5,87 23,87 24,88 26.5,88 27.5,89 30,89 31,90 33.5,90 34.5,91 v37,91 39,93 R28.1 | v52,70 59,70 67.5,78.5 IC8.4
  Bottom 0.5: v37,91 46,82 46,73 49,70 v52,70
LED_10  (via drill 0.4 pad 0.8)
  Top 0.5: IC3.6 18.46,44.54 18,45 16.5,45 11,50.5 11,82.5 11.5,83 13,83 14,84 16.5,84 17.5,85 20,85 21,86 23.5,86 24.5,87 27,87 28,88 30.5,88 31.5,89 34,89 35,90 37.5,90 38.5,91 v41,91 43,93 R29.1 | v52,71 58.5,71 64.96,77.46 IC8.2
  Bottom 0.5: v41,91 47,85 47,73.5 49.5,71 v52,71
LED_11  (via drill 0.4 pad 0.8)
  Top 0.5: IC3.3 22.27,45.73 21,47 16,47 12,51 12,81.5 12.5,82 13.5,82 14.5,83 17,83 18,84 20.5,84 21.5,85 24,85 25,86 27.5,86 28.5,87 31,87 32,88 34.5,88 35.5,89 38,89 39,90 41.5,90 42.5,91 v45,91 47,93 R30.1 | v52,72 58,72 63.69,77.69 IC8.1
  Bottom 0.5: v45,91 48,88 48,74 50,72 v52,72
LED_12  (via drill 0.4 pad 0.8)
  Top 0.5: IC4.11 21,49 20,48 16.5,48 13,51.5 13,80.5 13.5,81 14,81 15,82 17.5,82 18.5,83 21,83 22,84 24.5,84 25.5,85 28,85 29,86 31.5,86 32.5,87 35,87 36,88 38.5,88 39.5,89 42,89 43,90 45.5,90 46.5,91 v49,91 51,93 R31.1 | v51.5,83 51.5,81.11 IC5.13
  Bottom 0.5: v51.5,83 49,85.5 v49,91
LED_13  (via drill 0.4 pad 0.8)
  Top 0.5: IC4.8 17.19,50.19 17,50 16,50 14,52 14,79.5 15.5,81 18,81 19,82 21.5,82 22.5,83 25,83 26,84 28.5,84 29.5,85 32,85 33,86 35.5,86 36.5,87 39,87 40,88 42.5,88 43.5,89 46,89 47,90 49.5,90 50.5,91 52.95,91 v52.98,91.03 R32.1 | v66.25,90 66.25,89.75 66.23,89.73 IC8.12
  Bottom 0.5: v66.25,90 54,90 v52.98,91.03
LED_14  (via drill 0.4 pad 0.8)
  Top 0.5: IC4.6 18.46,59.54 18,60 16,60 15,61 15,79 16,80 18.5,80 19.5,81 22,81 23,82 25.5,82 26.5,83 29,83 30,84 32.5,84 33.5,85 36,85 37,86 39.5,86 40.5,87 43,87 44,88 46.5,88 47.5,89 50,89 51,90 53.5,90 54.5,91 v57,91 59,93 R33.1 | IC5.11 54,82.75 v54.5,83.25
  Bottom 0.5: v57,91 56,92 52,92 51,91 51,90 54.5,86.5 v54.5,83.25
LED_15
  Top 0.5: IC4.3 22.27,60.73 21,62 17,62 16,63 16,78.5 16.5,79 19,79 20,80 22.5,80 23.5,81 26,81 27,82 29.5,82 30.5,83 33,83 34,84 36.5,84 37.5,85 40,85 41,86 43.5,86 44.5,87 47,87 48,88 50.5,88 51.5,89 54,89 55,90 57.5,90 58.5,91 60.95,91 R34.1 67.45,93.05 70.04,90.46 IC8.9
N$1
  Top 0.5: R2.2 83,45.49 S1.4 S1.3
N$2
  Top 0.5: R20.2 LED2.A
N$3  (via drill 0.4 pad 0.8)
  Top 0.5: U1.29 82.95,37.48 R1.1 | v91.5,40.75 85.7,40.75 R1.1 | R2.1 83,38.05 R1.1
  Bottom 0.5: J3.5 92.73,41.98 v91.5,40.75
N$4  (via drill 0.4 pad 0.8)
  Top 0.5: U1.17 93.84,33 v94.5,33
  Bottom 0.5: v94.5,33 90.25,37.25 90.25,47.52 J3.3
N$5
  Top 0.5: IC6.2 21.46,64.54 23,63 30.5,63 33.23,65.73 IC7.5
N$6
  Top 0.5: IC6.4 24,65 25,64 30,64 33,67 IC7.4
N$7
  Top 0.5: R21.2 LED3.A
N$8
  Top 0.5: IC6.6 26.54,66.46 27,66 28.75,66 33.56,70.81 IC7.1
N$9
  Top 0.5: IC6.8 27.81,75.81 28,76 39,76 43,72 43,70 42.54,69.54 IC7.13
N$10
  Top 0.5: IC6.10 25.27,76.27 26,77 39.5,77 44,72.5 44,69 43.27,68.27 IC7.12
N$11
  Top 0.5: R22.2 LED4.A
N$12
  Top 0.5: IC5.2 51.46,73.46 42.46,64.46 IC7.9
N$13
  Top 0.5: R23.2 LED5.A
N$14
  Top 0.5: R24.2 LED6.A
N$15
  Top 0.5: R25.2 LED7.A
N$16
  Top 0.5: R26.2 LED8.A
N$17
  Top 0.5: IC8.10 68.77,90.23 67.5,91.5 63,91.5 56.5,85 54.5,85 52.73,83.23 IC5.12
N$18
  Top 0.5: R27.2 LED9.A
N$19
  Top 0.5: IC8.13 64.96,90 63,90 55.27,82.27 IC5.10
N$20
  Top 0.5: R28.2 LED10.A
N$21
  Top 0.5: IC7.8 42.69,63.19 47.5,68 60,68 66.5,74.5 69,74.5 70.73,72.77 IC9.12
N$22
  Top 0.5: IC7.6 33.46,64.46 32,63 32,62 33,61 42,61 48,67 60.5,67 67,73.5 68.5,73.5 69.46,72.54 IC9.13
N$23
  Top 0.5: IC8.6 70.04,79.96 73.27,76.73 IC9.10
N$24
  Top 0.5: IC9.9 74.54,76.87 72.5,78.91 72.5,86.75 71.31,87.94 IC8.8
N$25
  Top 0.5: R29.2 LED11.A
N$26
  Top 0.5: R30.2 LED12.A
N$27
  Top 0.5: R31.2 LED13.A
N$28
  Top 0.5: R32.2 LED14.A
N$29
  Top 0.5: R33.2 LED15.A
N$30
  Top 0.5: R34.2 LED16.A
N$31
  Top 0.5: U1.12 93,27.43 93,24.5 84.25,15.75 S2.3 S2.4
N$32
  Top 0.5: R38.2 88,45.95 88,48.5 86.5,50 84,50 82.75,51.25 82.75,72.25 74.5,80.5 74.5,87.58 74,88.08 LED19.A
N$33
  Top 0.5: R19.2 LED1.A
N$34
  Top 0.5: U1.23 92.75,39.58 92.75,41.25 90.95,43.05 R38.1
N$35
  Top 0.5: R37.2 84.75,66.3 84.75,71.83 76.65,79.93 76.65,92.7 75.75,93.6 74.79,93.6 74,94.39 LED20.A
N$37
  Top 0.5: R35.2 75.54,76.66 75.54,77.29 73.5,79.33 73.5,87.16 72.71,87.96 72.71,90.46 LED17.A
N$50
  Top 0.5: IC9.8 75.81,73.61 R35.1
N$51
  Top 0.5: LS1.2 100,55.8 100,31.67 96.33,28 93.57,28 U1.13
N$52
  Top 0.5: R36.2 LED18.A
N$53
  Top 0.5: J3.1 91,50.81 91,46.75 97,40.75 97,33 95,31 93.96,31 U1.16
N$54
  Top 0.5: J3.4 98,47.27 98,32.5 95.5,30 93.83,30 U1.15
N$55
  Top 0.5: U1.14 93.7,29 95.91,29 99,32.09 99,55.25 94.25,60 R37.1

### Text on the board
tPlace: Säkerhets-SM 2021 Final / https://sakerhetssm.se | Skum Hårdvara | Skum Logik | Skumma instruktioner | JLCJLCJLCJLC | RESET | PWR | both USB / power only | SUBMIT | Design: / Mateusz Drwal / me@mateuszdrwal.com